# Altium project QCopterNano.PrjPCB
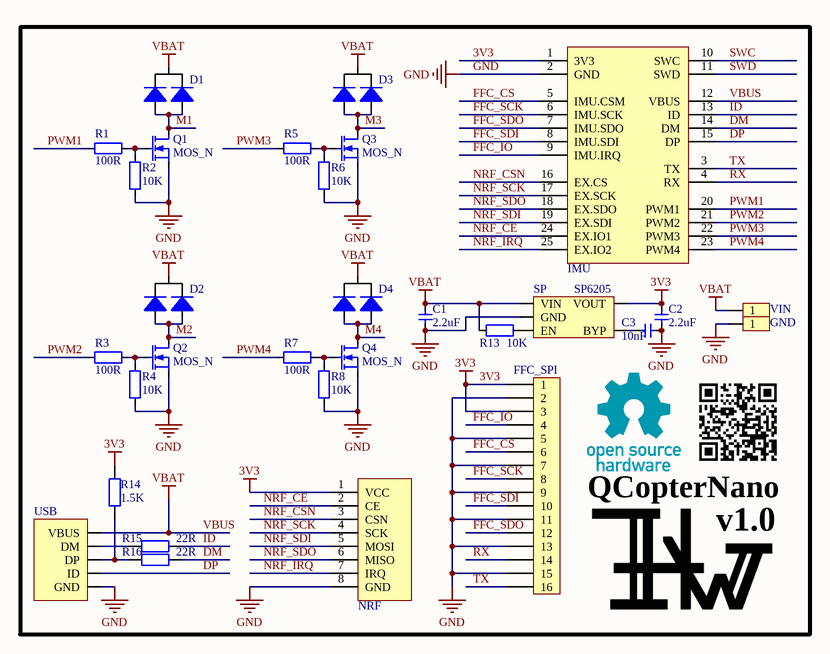
[diagram p0: QCopterNano_Sch.SchDoc]
1 sheet, 33 parts. Net scope: global (net labels, ports and power ports of the same name join across sheets).
Board file: QCopterNano_Pcb.PcbDoc

## Sheet QCopterNano_Sch.SchDoc
size A4

### Parts
C1  value 2.2uF  [CAP_0603]  (hidden comment: Cap_0603)
C2  value 2.2uF  [CAP_0603]  (hidden comment: Cap_0603)
C3  value 10nF  [CAP_0603]  (hidden comment: Cap_0603)
D1  Diode_Schottky2  [SOT23-3]  (value not drawn)
D2  Diode_Schottky2  [SOT23-3]  (value not drawn)
D3  Diode_Schottky2  [SOT23-3]  (value not drawn)
D4  Diode_Schottky2  [SOT23-3]  (value not drawn)
FFC_SPI  FFC_0.5_16  [FFC_0.5_16]  (value not drawn)
GND  HDR1X1_180_2.54  [HDR1X1_180_2.54]  (value not drawn)
HW  HW  [Logo_HW_v2.0]  (value not drawn)
IMU  SmartIMU_Full  [SMART_IMU_FULL]  (value not drawn)
NRF  nRF24L01P_PA_LNA  [NRF24L01P_PA_LNA]  (value not drawn)
ORCODE  QCopterNano_ORCODE  (value not drawn)
OSHW  OSHW  (value not drawn)
Q1  MOS_N  [SOT23-3]
Q2  MOS_N  [SOT23-3]
Q3  MOS_N  [SOT23-3]
Q4  MOS_N  [SOT23-3]
R1  value 100R  [RES_0603]  (hidden comment: Res_0603)
R2  value 10K  [RES_0603]  (hidden comment: Res_0603)
R3  value 100R  [RES_0603]  (hidden comment: Res_0603)
R4  value 10K  [RES_0603]  (hidden comment: Res_0603)
R5  value 100R  [RES_0603]  (hidden comment: Res_0603)
R6  value 10K  [RES_0603]  (hidden comment: Res_0603)
R7  value 100R  [RES_0603]  (hidden comment: Res_0603)
R8  value 10K  [RES_0603]  (hidden comment: Res_0603)
R13  value 10K  [RES_0603]  (hidden comment: Res_0603)
R14  value 1.5K  [RES_0603]  (hidden comment: Res_0603)
R15  value 22R  [RES_0603]  (hidden comment: Res_0603)
R16  value 22R  [RES_0603]  (hidden comment: Res_0603)
SP  SP6205  [SOT23-5]
USB  USB_Micro  [USB_Micro-AB]  (value not drawn)
VIN  HDR1X1_180_2.54  [HDR1X1_180_2.54]  (value not drawn)

### Blocks framed on the sheet
QCopterNano: C1-C3 D1-D4 FFC_SPI GND IMU NRF ORCODE OSHW Q1-Q4 R1-R8 R13-R16 SP USB VIN
v1.0: HW

### Nets
3V3: C2.2 FFC_SPI.1 FFC_SPI.3 IMU.1(3V3) NRF.1(VCC) R14.2 SP.5(VOUT)
GND: C1.1 C2.1 C3.1 FFC_SPI.2 FFC_SPI.5 FFC_SPI.7 FFC_SPI.9 FFC_SPI.11 FFC_SPI.13 FFC_SPI.15 GND.1 IMU.2(GND) NRF.8(GND) Q1.2(S) Q2.2(S) Q3.2(S) Q4.2(S) R2.1 R4.1 R6.1 R8.1 SP.2(GND) USB.5(GND)
VBUS: C1.2 D1.3(K) D2.3(K) D3.3(K) D4.3(K) IMU.12(VBUS) R13.1 SP.1(VIN) USB.1(VBUS) VIN.1  [also labelled VBAT]
DM: IMU.14(DM) R16.2
DP: IMU.15(DP) USB.4(ID)
FFC_CS: FFC_SPI.6 IMU.5(IMU.CSM)
FFC_IO: FFC_SPI.4 IMU.9(IMU.IRQ)
FFC_SCK: FFC_SPI.8 IMU.6(IMU.SCK)
FFC_SDI: FFC_SPI.10 IMU.8(IMU.SDI)
FFC_SDO: FFC_SPI.12 IMU.7(IMU.SDO)
ID: IMU.13(ID) R15.2
M1: D1.1(A) D1.2(A) Q1.3(D)
M2: D2.1(A) D2.2(A) Q2.3(D)
M3: D3.1(A) D3.2(A) Q3.3(D)
M4: D4.1(A) D4.2(A) Q4.3(D)
NRF_CE: IMU.24(EX.IO1) NRF.2(CE)
NRF_CSN: IMU.16(EX.CS) NRF.3(CSN)
NRF_IRQ: IMU.25(EX.IO2) NRF.7(IRQ)
NRF_SCK: IMU.17(EX.SCK) NRF.4(SCK)
NRF_SDI: IMU.19(EX.SDI) NRF.5(MOSI)
NRF_SDO: IMU.18(EX.SDO) NRF.6(MISO)
PWM1: IMU.20(PWM1) R1.1
PWM2: IMU.21(PWM2) R3.1
PWM3: IMU.22(PWM3) R5.1
PWM4: IMU.23(PWM4) R7.1
RX: FFC_SPI.14 IMU.4(RX)
SWC: IMU.10(SWC)
SWD: IMU.11(SWD)
TX: FFC_SPI.16 IMU.3(TX)
NetC3_2: C3.2 SP.4(BYP)
NetQ1_1: Q1.1(G) R1.2 R2.2
NetQ2_1: Q2.1(G) R3.2 R4.2
NetQ3_1: Q3.1(G) R5.2 R6.2
NetQ4_1: Q4.1(G) R7.2 R8.2
NetR13_2: R13.2 SP.3(EN)
NetR14_1: R14.1 R16.1 USB.3(DP)
NetR15_1: R15.1 USB.2(DM)

### Library data of the parts
C1-C3 = Cap_0603: Capacitor
D1-D4 = Diode_Schottky2: Diode
FFC_SPI = FFC_0.5_16: FFC
GND VIN = HDR1X1_180_2.54: Header
HW = HW: Logo
IMU = SmartIMU_Full: Module
NRF = nRF24L01P_PA_LNA: Module
ORCODE = QCopterNano_ORCODE: Logo
OSHW = OSHW: Logo
Q1-Q4 = MOSFET_N: MOSFET; Note: Pin 2 is electrically connected to pin 4.; Published: 8-Jun-2000; LatestRevisionDate: 17-Jul-2002; LatestRevisionNote: Re-released for DXP Platform.; DatasheetVersion: PD-9.814; PackageVersion: Feb-1997; PackageReference: TO-220AB; Publisher: Altium Limited; PackageDescription: TO, Thru-Hole, Vertical, Heatsink Mounted; 3 In-Line Leads; Pitch 2.54 mm; ComponentLink1Description: Manufacturer Link; ComponentLink1URL: http://www.irf.com/
R1-R8 R13-R16 = Res_0603: Resistor
SP = SP6205: Power
USB = USB_Micro: USB